# EAGLE schematic ch3 (EAGLE 9.2.2)
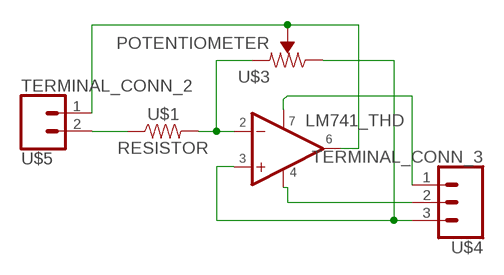
[diagram p0: schematic, sheet 1]

## Parts
U$1  RESISTOR  [RESISTOR]
U$2  IC-LM741  [IC-LM741]
U$3  POTENTIOMETER  [POTENTIOMETER]
U$4  TERMINAL_CONN_3  [TERMINAL-CONN_3]
U$5  TERMINAL_CONN_2  [TERMINAL_CONN_2]

## Nets
N$1: U$1.2 U$2.2(-IN) U$3.1(CCW)
N$2: U$2.6(OUT) U$3.2(WIPER) U$5.1
N$3: U$2.3(+IN) U$3.3(CW) U$4.3
N$4: U$2.4 U$4.2
N$6: U$2.7 U$4.1
N$7: U$1.1 U$5.2

## Library data of the parts
U$1 = ECE5_WS(7):RESISTOR: This is a resistor
U$2 = ECE5_WS(7):IC-LM741: This is an IC (Integrated Circuit) LM741 in lab2
U$3 = ECE5_WS(7):POTENTIOMETER: This is a potentiometer
U$4 = ECE5_WS(7):TERMINAL_CONN_3: This is a 3 pin terminal block
U$5 = ECE5_WS(7):TERMINAL_CONN_2: 2 pin terminal block